# Altium schematic sheet lab.SchDoc
size E
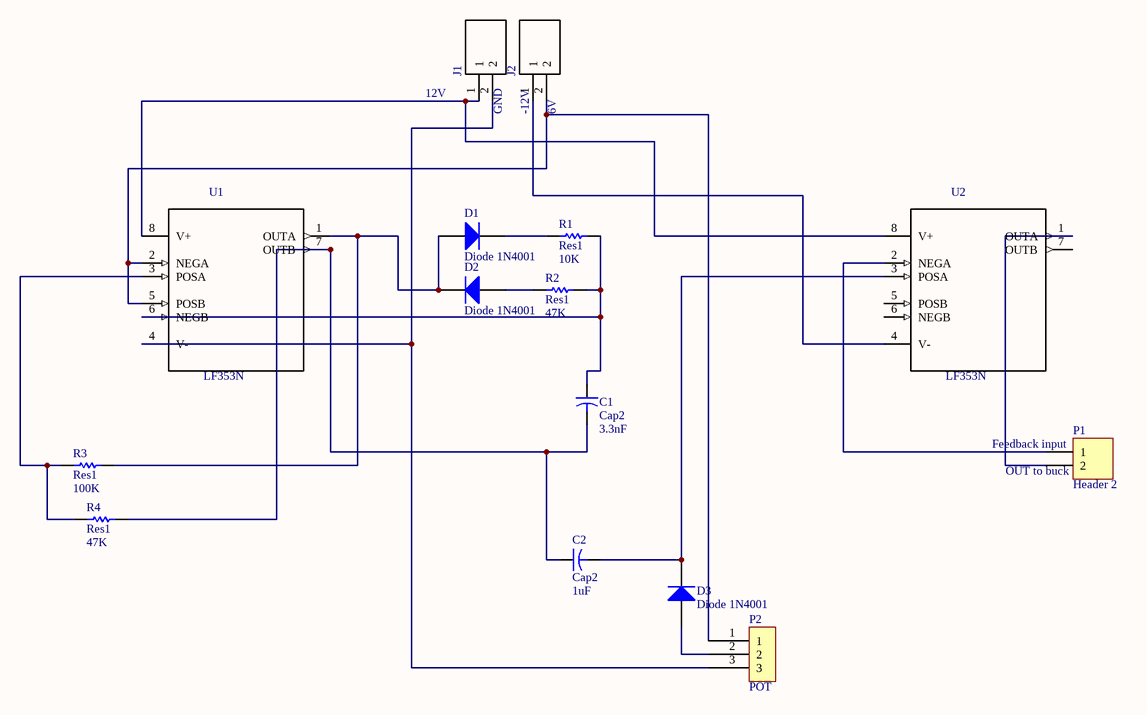
[diagram p0: lab.SchDoc]

## Parts
C1  Cap2  value 3.3nF  [CAPR5-4X5]
C2  Cap2  value 1uF  [CAPR5-4X5]
D1  Diode 1N4001  [DO-41]
D2  Diode 1N4001  [DO-41]
D3  Diode 1N4001  [DO-41]
J1  1546215-2  [*TE_1546215-2]  (value not drawn)
J2  1546215-2  [*TE_1546215-2]  (value not drawn)
P1  Header 2  [HDR1X2]
P2  POT  [POT]
R1  Res1  value 10K  [AXIAL-0.3]
R2  Res1  value 47K  [AXIAL-0.3]
R3  Res1  value 100K  [AXIAL-0.3]
R4  Res1  value 47K  [AXIAL-0.3]
U1  LF353N  [*DIP254P762X508-8]
U2  LF353N  [*DIP254P762X508-8]

## Nets
NetC1_1: C1.1 R1.2 R2.2 U1.6(NEGB)
NetC1_2: C1.2 C2.1 R4.2 U1.7(OUTB)
NetC2_2: C2.2 D3.2(K) U2.3(POSA)
NetD1_1: D1.1(A) D2.2(K) R3.2 U1.1(OUTA)
NetD1_2: D1.2(K) R1.1
NetD2_1: D2.1(A) R2.1
NetD3_1: D3.1(A) P2.2
NetJ1_1: J1.1 U1.8(V+) U2.8(V+)
NetJ1_2: J1.2 P2.3 U1.4(V-)
NetJ2_1: J2.1 U2.4(V-)
NetJ2_2: J2.2 P2.1 U1.2(NEGA) U1.5(POSB)
NetP1_1: P1.1 U2.2(NEGA)
NetP1_2: P1.2 U2.1(OUTA)
NetR3_1: R3.1 R4.1 U1.3(POSA)

Not connected (* = marked no-connect by the designer): U2 5(POSB) 6(NEGB) 7(OUTB)

## Notes on the sheet
- (near J1) 12V
- GND
- (near J2) -12V
- (near J2) 6V
- (near P1) Feedback input
- (near P1) OUT to buck

## Library data of the parts
C1 C2 = Cap2: Capacitor; Published: 23-Sep-2002; PackageReference: CAPR5-4X5; Publisher: Altium Limited; PackageDescription: Capacitor; 2 Leads
D1-D3 = Diode 1N4001: 1 Amp General Purpose Rectifier; Published: 8-Jun-2000; LatestRevisionDate: 17-Jul-2002; LatestRevisionNote: Re-released for DXP Platform.; DatasheetVersion: 1998; PackageVersion: Aug-1999; PackageReference: DO-41; Publisher: Altium Limited; PackageDescription: Diode, Axial; Body 5.2 x 2.7 mm (LxDia. max), Lead Dia. 0.86 mm (max); Code_JEDEC: DO-204-AL; ComponentLink1Description: Manufacturer Link; ComponentLink1URL: http://www.fairchildsemi.com/; ComponentLink2Description: Datasheet; ComponentLink2URL: http://www.fairchildsemi.com/ds/1N%2F1N4001.pdf
J1 J2 = 1546215-2: TERMI-BLOK PCB MOUNT, 90 2P.; MF: TE Connectivity; Price: None; EU_RoHS_Compliance: Compliant with Exemptions; Package: None; TE_purchase_URL: https://www.te.com/usa-en/product-1546215-2.html?te_bu=Cor&te_type=disp&te_campaign=seda_glo_cor-seda-global-disp-prtnr-fy19-seda-model-bom-cta_sma-317_1&elqCampaignId=32493; MP: 1546215-2; Availability: Unavailable; SnapEDA_Link: https://www.snapeda.com/parts/1546215-2/TE%20Connectivity%20AMP%20Connectors/view-part/?ref=snap; Value: *
P1 = Header 2: Header, 2-Pin; LatestRevisionDate: 17-Jul-2002; LatestRevisionNote: Re-released for DXP Platform.; Publisher: Altium Limited
P2 = POT: JST (JAPAN SOLDERLESS TERMINALS) - B8B-XH-A (LF)(SN) - HEADER, VERTICAL, 8WAY; No of Positions: 8; Pitch: 2.5 mm; Style/Orientation: Straight Header/Plug; Supplier 1: Digi-Key; Manufacturer: JST; Manufacturer Part Number: B8B-XH-A(LF)(SN); Stock 1: 29643; Pricing 1: 1=0.36, 10=0.341, 100=0.2387, 500=0.2046, 1000=0.1705, 5000=0.1461, 10000=0.1364 (USD); Type: Shrouded Header; Termination: Crimp; ComponentLink1URL: https://www.verical.com/server-webapp/html/getDatasheet?partID=440408&src-supplier=Verical; ComponentLink1Description: https://www.verical.com/server-webapp/html/getDatasheet?partID=440408&src-supplier=Verical; Supplier Part Number 1: 455-2251-ND
R1-R4 = Res1: Resistor; Published: 8-Jun-2000; LatestRevisionDate: 17-Jul-2002; LatestRevisionNote: Re-released for DXP Platform.; PackageReference: AXIAL-0.3; Publisher: Altium Limited; PackageDescription: Axial Device, Thru-Hole; 2 Leads; 0.3 in Pin Spacing
U1 U2 = LF353N: 8 pin Wide Bandwidth Dual JFET Input Operational Amplifier 40 per tube; MF: STMicroelectronics; MP: LF353N; SnapEDA_Link: https://www.snapeda.com/parts/LF353N/STMicroelectronics/view-part/?ref=snap; Availability: Unavailable; Package: DIP-8 Texas Instruments; Price: None; Value: *